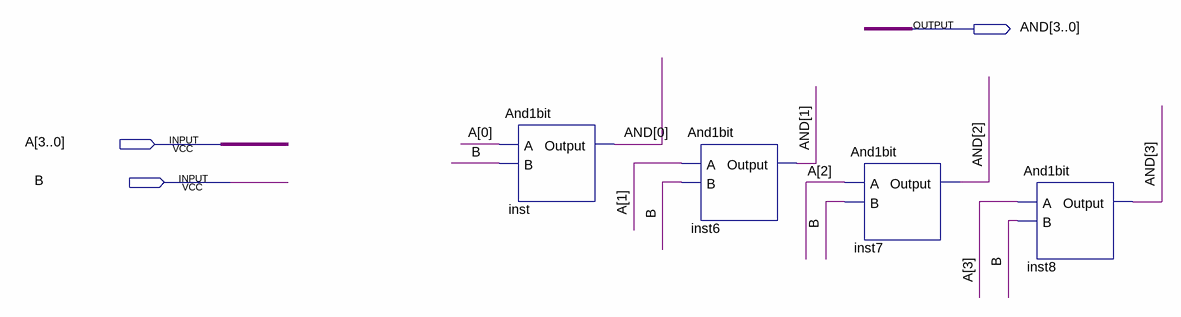
[diagram p0: schematic sheet]
// Quartus schematic and4_1bit.bdf as structural Verilog: 4 symbols, 3 pins
module and4_1bit (
  input  [3:0] A,
  input  B,
  output [3:0] AND
);

  And1bit inst (.A(A[0]), .B(B), .Output(AND[0]));
  And1bit inst6 (.A(A[1]), .B(B), .Output(AND[1]));
  And1bit inst7 (.A(A[2]), .B(B), .Output(AND[2]));
  And1bit inst8 (.A(A[3]), .B(B), .Output(AND[3]));
endmodule
